# Altium project EP4_ECD_Electrica_Power_System.PrjPcb
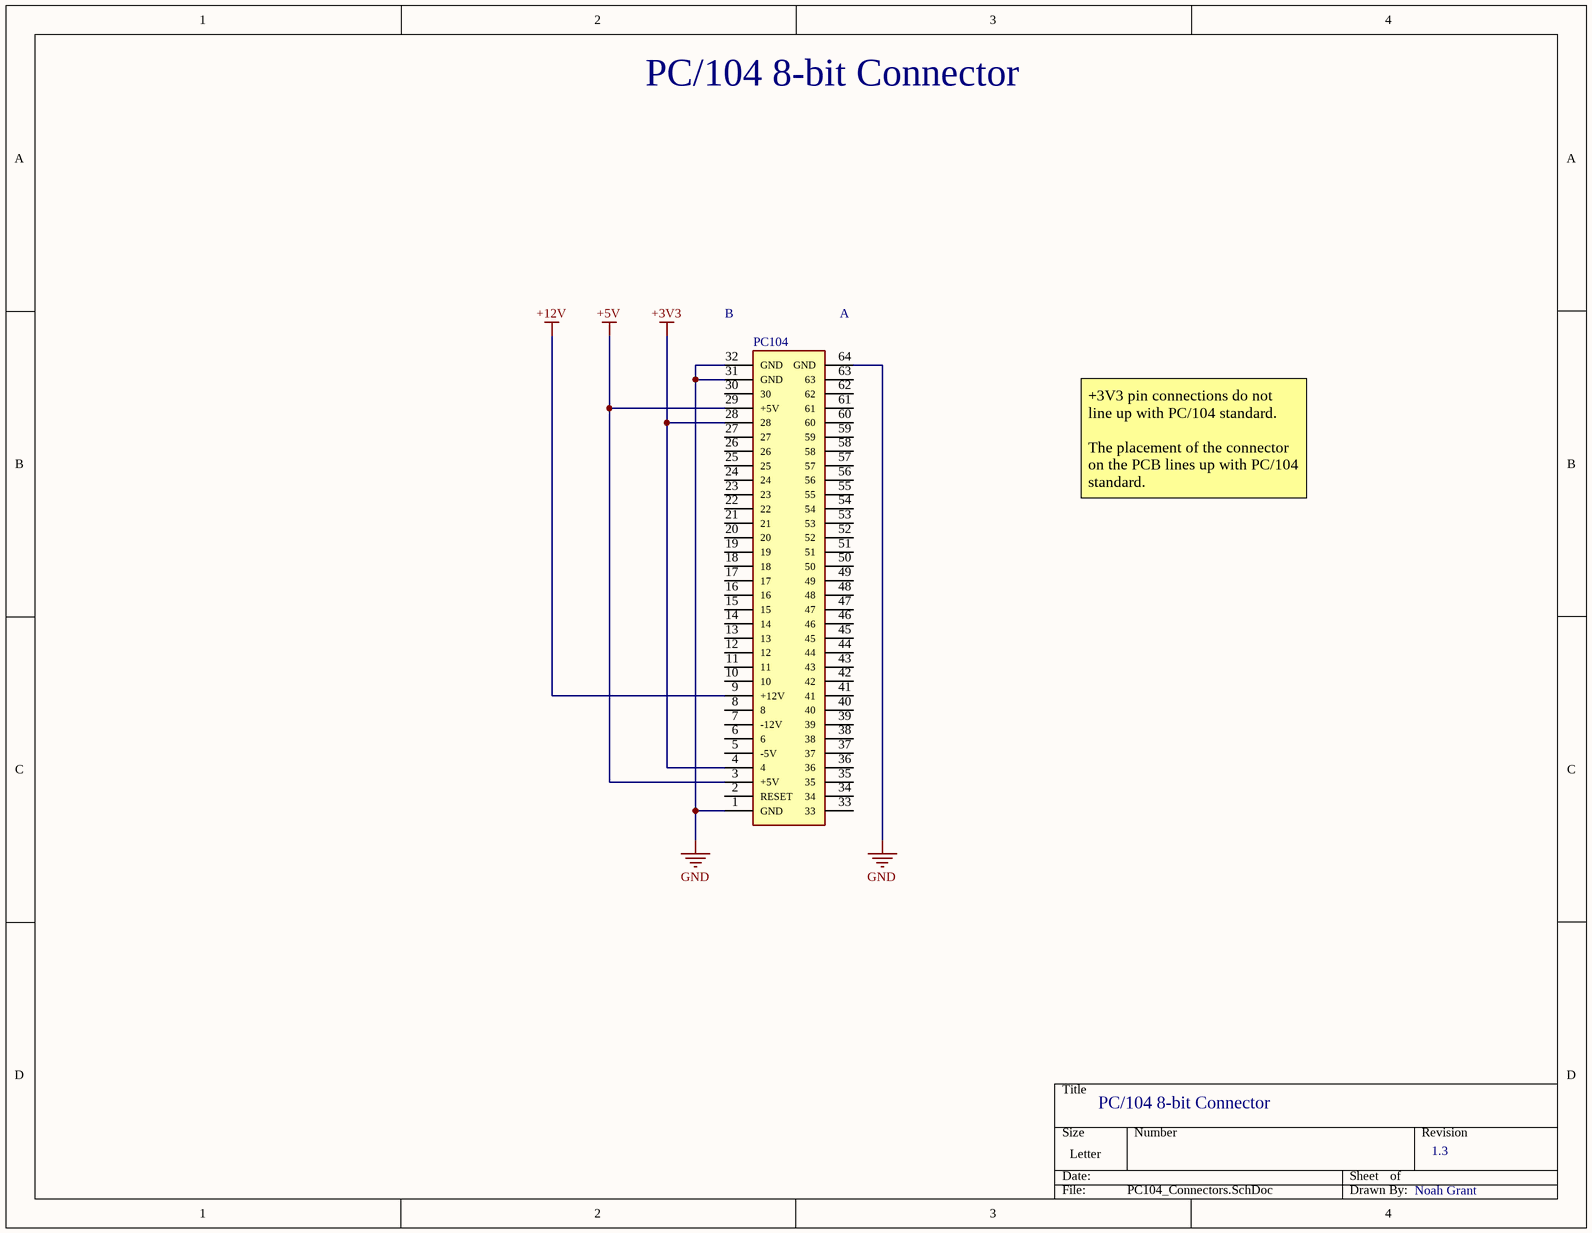
[diagram p0: PC104_Connectors.SchDoc]
3 sheets, 41 parts. Net scope: global (net labels, ports and power ports of the same name join across sheets).
Board file: PWR.PcbDoc
Sheets:
  PC104_Connectors.SchDoc
  Power.SchDoc
  R-Pi3.SchDoc

## Sheet PC104_Connectors.SchDoc
size Letter; SheetNumber: 1; SheetTotal: 2

### Parts
PC104  10153302-32111LF  [RHDR64W74P254_2X32_8238X499X1115P]  (value not drawn)

### Nets
+3V3: PC104.4 PC104.28
+5V: PC104.3(+5V) PC104.29(+5V)
+12V: PC104.9(+12V)
GND: PC104.1(GND) PC104.31(GND) PC104.32(GND) PC104.64(GND)

Not connected (* = marked no-connect by the designer): PC104 2(RESET) 5(-5V) 6 7(-12V) 8 10 11 12 13 14 15 16 17 18 19 20 21 22 23 24 25 26 27 30 33 34 35 36 37 38 39 40 41 42 43 44 45 46 47 48 49 50 51 52 53 54 55 56 57 58 59 60 61 62 63

### Notes on the sheet
- PC/104 8-bit Connector
- (near PC104) B
- (near PC104) A
- +3V3 pin connections do not line up with PC/104 standard.
  The placement of the connector on the PCB lines up with PC/104 standard.
- 1.3
- Noah Grant

### Library data of the parts
PC104 = 10153302-32111LF: Connector; Manufacturer_Name: Amphenol Communication Solutions; Datasheet Link: https://cdn.amphenol-cs.com/media/wysiwyg/files/drawing/10153302.pdf; Height: 11.15mm; Manufacturer_Part_Number: 10153302-32111LF

## Sheet Power.SchDoc: ECD PWR Board
size Letter; Date: 2023-01-12; Author: Noah Grant; CompanyName: ESE W23; DrawnBy: Noah Grant; Organization: Conestoga College; SheetNumber: 2; SheetTotal: 3
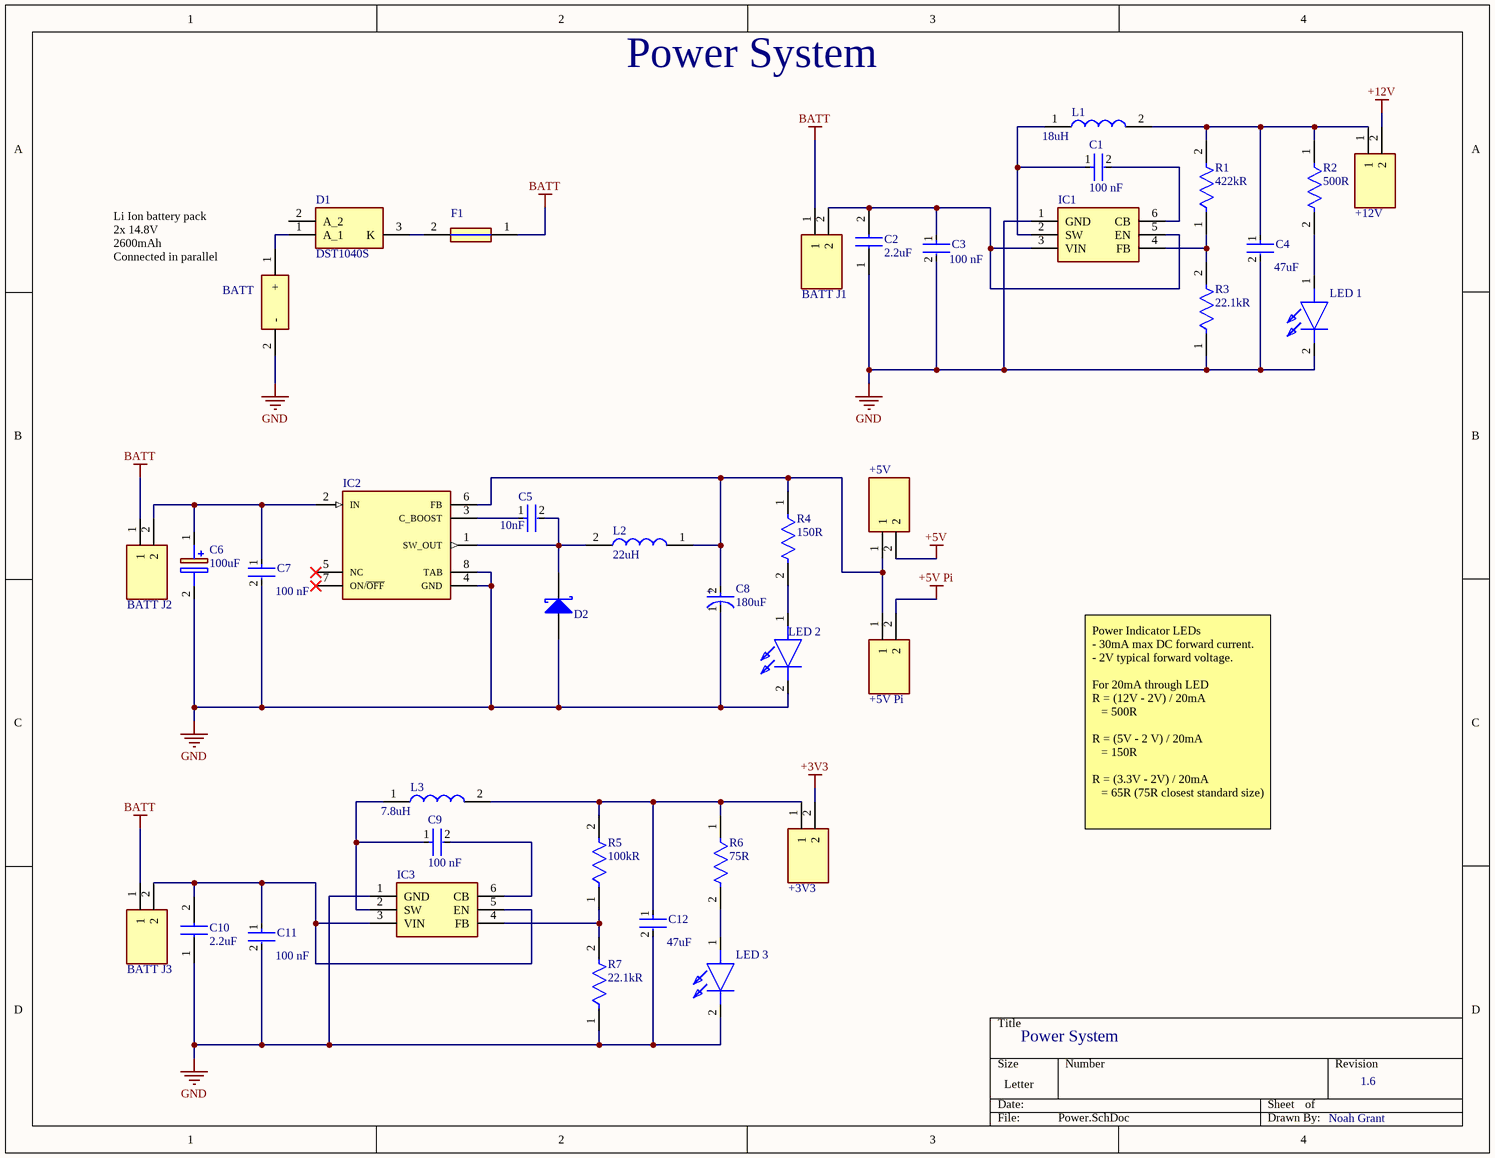
[diagram p1: Power.SchDoc]

### Parts
+3V3  0022284023  [HDRV2W87P0X254_1X2_508X249X863P]  (value not drawn)
+5V  0022284023  [HDRV2W87P0X254_1X2_508X249X863P]  (value not drawn)
+5V_Pi  0022284023  [HDRV2W87P0X254_1X2_508X249X863P]  (value not drawn)
+12V  0022284023  [HDRV2W87P0X254_1X2_508X249X863P]  (value not drawn)
BATT  1702473  [1702473]  (value not drawn)
BATT_J1  0022284023  [HDRV2W87P0X254_1X2_508X249X863P]  (value not drawn)
BATT_J2  0022284023  [HDRV2W87P0X254_1X2_508X249X863P]  (value not drawn)
BATT_J3  0022284023  [HDRV2W87P0X254_1X2_508X249X863P]  (value not drawn)
C1  Capacitance: 100 nF  [FP-CC0603-DA-MFG]  (hidden comment: CC0603KPX7R9BB104)
C2  Capacitance: 2.2uF  [CAPC3216X180N]  (hidden comment: GRM31CR61H225KA88L)
C3  Capacitance: 100 nF  [FP-CC0603-DA-MFG]  (hidden comment: CC0603KPX7R9BB104)
C4  Capacitance: 47uF  [FP-GRM32E-0_3-0_2-IPC_C]  (hidden comment: GRM32ER61C476KE15L)
C5  Capacitance: 10nF  [FP-CGA4J-IPC_B]  (hidden comment: CGA4C2C0G1H103J060AA)
C6  Capacitance: 100uF  [CAPAE1030X1050N]  (hidden comment: 50PFV100M10X10.5)
C7  Capacitance: 100 nF  [FP-CC0603-DA-MFG]  (hidden comment: CC0603KPX7R9BB104)
C8  Capacitance: 180uF  [FP-OS-CON-SMT-C6-MFG]  (hidden comment: 16SVPF180M)
C9  Capacitance: 100 nF  [FP-CC0603-DA-MFG]  (hidden comment: CC0603KPX7R9BB104)
C10  Capacitance: 2.2uF  [CAPC3216X180N]  (hidden comment: GRM31CR61H225KA88L)
C11  Capacitance: 100 nF  [FP-CC0603-DA-MFG]  (hidden comment: CC0603KPX7R9BB104)
C12  Capacitance: 47uF  [FP-GRM32E-0_3-0_2-IPC_C]  (hidden comment: GRM32ER61C476KE15L)
D1  DST1040S  [DST1040SA]
D2  B560C-13-F  [DIOD-B5X0C-2_M]  (value not drawn)
F1  TR2_6125FF5-R  [FUSC8640X287N]  (value not drawn)
IC1  LMR51420XDDCR  [SOT95P280X110-6N]  (value not drawn)
IC2  LM2677SX-5.0/NOPB  [TO127P1435X464-8N]  (value not drawn)
IC3  LMR51420XDDCR  [SOT95P280X110-6N]  (value not drawn)
L1  Inductance: 18uH  [SRR1210]  (hidden comment: SRR1210-180M)
L2  Inductance: 22uH  [INDPM132125X500N]  (hidden comment: MPX1D1250L220)
L3  Inductance: 7.8uH  [WE-HCI_103023]  (hidden comment: 744325780)
LED_1  APL3015EC-F01  [APL3015ECF01]  (value not drawn)
LED_2  APL3015EC-F01  [APL3015ECF01]  (value not drawn)
LED_3  APL3015EC-F01  [APL3015ECF01]  (value not drawn)
R1  Resistance: 422kR  [FP-ERA6A-IPC_A]  (hidden comment: ERA-6AEB4223V)
R2  500R  [FP-TFCR0603-IPC_A]
R3  Resistance: 22.1kR  [FP-RNCP0805-IPC_C]  (hidden comment: RNCP0805FTD22K1)
R4  150R  [FP-MCT0603-IPC_C]
R5  Resistance: 100kR  [FP-RC0603-0_55-MFG]  (hidden comment: RC0603FR-07100KL)
R6  75R  [FP-RT0603-MFG]
R7  Resistance: 22.1kR  [FP-RNCP0805-IPC_C]  (hidden comment: RNCP0805FTD22K1)

### Nets
+3V3: +3V3.2
+5V: +5V.2
+5V Pi: +5V_Pi.2
+12V: +12V.2
BATT: BATT_J1.1 BATT_J2.1 BATT_J3.1 F1.1
GND: BATT.2(-) C2.1 C3.2 C4.2 C6.2(-) C7.2 C8.1(C) C10.1 C11.2 C12.2 D2.2(A) IC1.1(GND) IC2.4(GND) IC2.8(TAB) IC3.1(GND) LED_1.2(K) LED_2.2(K) LED_3.2(K) R3.1 R7.1
Net+3V3_1: +3V3.1 C12.1 L3.2 R5.2 R6.1
Net+5V_1: +5V.1 +5V_Pi.1 C8.2(A) IC2.6(FB) L2.1 R4.1
Net+12V_1: +12V.1 C4.1 L1.2 R1.2 R2.1
NetBATT_1: BATT.1(+) D1.1(A_1)
NetBATT_J1_2: BATT_J1.2 C2.2 C3.1 IC1.3(VIN) IC1.5(EN)
NetBATT_J2_2: BATT_J2.2 C6.1(+) C7.1 IC2.2(IN)
NetBATT_J3_2: BATT_J3.2 C10.2 C11.1 IC3.3(VIN) IC3.5(EN)
NetC1_1: C1.1 IC1.2(SW) L1.1
NetC1_2: C1.2 IC1.6(CB)
NetC5_1: C5.1 IC2.3(C_BOOST)
NetC5_2: C5.2 D2.1(K) IC2.1(SW_OUT) L2.2
NetC9_1: C9.1 IC3.2(SW) L3.1
NetC9_2: C9.2 IC3.6(CB)
NetD1_3: D1.3(K) F1.2
NetIC1_4: IC1.4(FB) R1.1 R3.2
NetIC3_4: IC3.4(FB) R5.1 R7.2
NetLED_1_1: LED_1.1(A) R2.2
NetLED_2_1: LED_2.1(A) R4.2
NetLED_3_1: LED_3.1(A) R6.2

Not connected (* = marked no-connect by the designer): D1 2(A_2); IC2 5(NC)* 7(ON/~{OFF})*

### Notes on the sheet
- Power System
- (near BATT) Li Ion battery pack
  2x 14.8V
  2600mAh
  Connected in parallel
- Power Indicator LEDs
  - 30mA max DC forward current.
  - 2V typical forward voltage.
  For 20mA through LED
  R = (12V - 2V) / 20mA
  = 500R
  R = (5V - 2 V) / 20mA
  = 150R
  R = (3.3V - 2V) / 20mA
  = 65R (75R closest standard size)
- 1.6
- Noah Grant
- (in symbol CMP-05428-001090-1) +

### Library data of the parts
+3V3 +5V +5V_Pi +12V BATT_J1-BATT_J3 = 0022284023: Connector; Manufacturer_Name: Molex; Datasheet Link: https://www.molex.com/pdm_docs/sd/022284023_sd.pdf; Height: 8.63mm; Manufacturer_Part_Number: 0022284023; Mouser Part Number: N/A; Mouser Price/Stock: https://www.mouser.co.uk/ProductDetail/Molex/0022284023?qs=PBcRNPEHKsr%2FPE%2F%252B8ije0g%3D%3D; Arrow Part Number: 0022284023; Arrow Price/Stock: https://www.arrow.com/en/products/0022284023/molex
BATT = 1702473: Connector; Manufacturer_Name: Phoenix Contact; Datasheet Link: http://www.phoenixcontact.com/de/produkte/1702473/pdf; Height: 5.22mm; Manufacturer_Part_Number: 1702473; Mouser Part Number: 651-1702473; Mouser Price/Stock: https://www.mouser.co.uk/ProductDetail/Phoenix-Contact/1702473?qs=i0qWf6NAoDu6Kp2LncOlag%3D%3D; Arrow Part Number: 1702473; Arrow Price/Stock: https://www.arrow.com/en/products/1702473/phoenix-contact?region=nac
C1 C3 C7 C9 C11 = CMP-03422-000468-1: CAP CER 0.1UF 50V X7R 0603; Manufacturer: YAGEO; Temperature Coefficient: 15%; Material: Ceramic; Value: 100 nF; Tolerance: 0.1; Device Class L1: Passive Components; Temperature Range High: +125°C; ComponentLink2Description: Datasheet; Temperature Characteristic: X7R; Octopart: https://octopart.com/cc0603kpx7r9bb104-yageo-12885113; Height: 0.9mm; Mouser Description: Multilayer Ceramic Capacitors MLCC - SMD/SMT 100nF 50V X7R 10%; Device Class L3: Ceramic Capacitors; Voltage Rating: 50 V; Device Class L2: Capacitors; ComponentLink2URL: http://www.yageo.com/documents/recent/UPY-GPHC_X7R_6.3V-to-50V_18.pdf; Package: CC0603-DA; Manufacturer Part Number: CC0603KPX7R9BB104; Automotive: No; Voltage: 50 V; RoHS: TRUE; Lead Free: Yes; Digikey Description: CAP CER 0.1UF 50V X7R 0603; Footprint Url: http://www.yageo.com/exep/pages/download/literatures/UPY-C_GEN_24.pdf; Temperature Range Low: -55°C; Temperature: -55°C to +125°C; Category: Cap
C2 C10 = GRM31CR61H225KA88L: Capacitor; Manufacturer_Name: Murata Electronics; Datasheet Link: https://datasheet.datasheetarchive.com/originals/distributors/Datasheets_SAMA/ec4f1577dddcc7a13ddad897a28002d3.pdf; Height: 1.8mm; Manufacturer_Part_Number: GRM31CR61H225KA88L; Mouser Part Number: 81-GRM31CR61H225KA8L; Mouser Price/Stock: https://www.mouser.co.uk/ProductDetail/Murata-Electronics/GRM31CR61H225KA88L?qs=PNuoBeNXpiW6XsFe%2FHBnHw%3D%3D
C4 C12 = CMP-2000-06362-2: CAP CER 47UF 16V X5R 1210; Tolerance: 10%; Material: Ceramic; Case Code (Metric): 3225; RoHS Compliant: Yes; Min Operating Temperature: -55°C; Radiation Hardening: No; Voltage: 16V; Package Quantity: 1; Case Code (Imperial): 1210; REACH SVHC: No SVHC; Voltage Rating (DC): 16V; Dielectric: X5R; Case/Package: 1210; Length: 3.2mm; Voltage Rating: 16V; Packaging: Cut Tape; Width: 0.098inch; Number of Pins: 2; Lead Free: Lead Free; Height: 2.5mm; Mount: Surface Mount; Termination: SMD/SMT; Max Operating Temperature: 85°C; Thickness: 0.106inch; Depth: 2.5mm
C5 = CMP-08246-000595-1: Cap Ceramic 10nF 50V C0G 5% Pad SMD 0805 +125°C Automotive T/R; Max Operating Temperature: 125°C; Voltage Rating (DC): 50V; Packaging: Tape and Reel; Composition: Ceramic; Case/Package: 0805; REACH SVHC: No SVHC; Dielectric: C0G; Depth: 1.25mm; Min Operating Temperature: -55°C; Termination: SMD/SMT; Length: 2mm; Case Code (Metric): 2012; Thickness: 0.028inch; Ratings: AEC-Q200; Package Quantity: 1; Case Code (Imperial): 0805; Tolerance: 5%; Voltage Rating: 50V; Radiation Hardening: No; Lead Free: Lead Free; Height: 0.6mm; Mount: Surface Mount; Weight: 0.000194oz; Width: 0.049inch
C6 = 50PFV100M10X10.5: Capacitor Polarised; Manufacturer_Name: Rubycon; Datasheet Link: https://www.mouser.jp/datasheet/2/977/e_PFV-1600672.pdf; Height: 10.5mm; Manufacturer_Part_Number: 50PFV100M10X10.5; Mouser Part Number: 232-50PFV100M10X10.5; Mouser Price/Stock: https://www.mouser.co.uk/ProductDetail/Rubycon/50PFV100M10X10.5?qs=T3oQrply3y%252BvhjwV%252B%252Bv4tQ%3D%3D; Arrow Part Number: 50PFV100M10X10.5; Arrow Price/Stock: https://www.arrow.com/en/products/50pfv100m10x10.5/rubycon?region=nac
C8 = CMP-05428-001090-1: Conductive Polymer Aluminum Solid Capacitors (OS-CON) 180uF ±20% 16V; Polarity: Polar; Dissipation Factor: 12%; Ripple Current: 3.3A; ESR (Equivalent Series Resistance): 22mR; Leakage Current: 576uA; Life (Hours): 5000Hour; Min Operating Temperature: -55°C; REACH SVHC: No SVHC; Height: 5.9mm; Case/Package: Radial; Packaging: Tape and Reel; Termination: SMD/SMT; Max Operating Temperature: 105°C; Package Quantity: 1; RoHS Compliant: Yes; Number of Pins: 6; Tolerance: 20%; Lead Free: Lead Free; Mount: Surface Mount; Voltage Rating: 16V; Length: 5.9mm; Height - Seated (Max): 0.236inch; Voltage Rating (DC): 16V; Radiation Hardening: No; Voltage: 16V; Diameter: 6.3mm; Series: OS-CON™, SVPF; Ripple Current (AC): 3.3A; Construction: Cylindrical
D1 = DST1040S: Schottky Diode; Manufacturer_Name: LITTELFUSE; Datasheet Link: https://m.littelfuse.com/~/media/electronics/datasheets/power_semiconductors/littelfuse_power_semiconductor_schottky_diode_dst1040s_datasheet.pdf.pdf; Height: 1.25mm; Manufacturer_Part_Number: DST1040S; Mouser Part Number: 576-DST1040S; Mouser Price/Stock: https://www.mouser.co.uk/ProductDetail/Littelfuse/DST1040S?qs=%252BC9Bk%2FBEkFwEQIZlBedqnA%3D%3D; Arrow Part Number: DST1040S; Arrow Price/Stock: https://www.arrow.com/en/products/dst1040s/littelfuse
D2 = CMP-2000-05098-2: Schottky Barrier Rectifier, 5 A, 60 V, -55 to 125 degC, 2-Pin SMD, RoHS, Tape and Reel; Ir - Reverse Current: 500uA; Configuration: Single; Ifsm - Forward Surge Current: 100A; Vrrm - Repetitive Reverse Voltage: 60V; Brand: DiodesIncorporated; Vf - Forward Voltage: 0.7V; If - Forward Current: 5A; Unit Weight: 0.007408oz; Type: SchottkyBarrierRectifier; Package / Case: SMC; Manufacturer URL: http://www.diodes.com/; Datasheet URL: https://datasheet.ciiva.com/27052/1538961-27052355.pdf; Factory Pack Quantity: 3000; Height: 2.5mm; Width: 6.22mm; Product Category: SchottkyDiodes&Rectifiers; Minimum Operating Temperature: -55C; Manufacturer: DiodesIncorporated; Datasheet Version: Rev. 7-2, 06/2007; Product: SchottkyDiodes; Maximum Operating Temperature: +125C; Operating Temperature Range: -55Cto+125C; Technology: Si; Length: 7.11mm; RoHS: True; Packaging: Reel; Termination Style: SMD/SMT; Series: B560; Mounting Style: SMD/SMT
F1 = TR2_6125FF5-R: Fuse; Manufacturer_Name: Eaton; Manufacturer_Part_Number: TR2/6125FF5-R; Datasheet Link: https://ms.componentsearchengine.com/Datasheets/2/TR2_6125FF5-R.pdf; Height: 2.87mm
IC1 IC3 = LMR51420XDDCR: Integrated Circuit; Manufacturer_Name: Texas Instruments; Datasheet Link: https://www.ti.com/lit/ds/symlink/lmr51420.pdf?ts=1663231243064; Height: 1.1mm; Manufacturer_Part_Number: LMR51420XDDCR; Mouser Part Number: 595-LMR51420XDDCR; Mouser Price/Stock: https://www.mouser.co.uk/ProductDetail/Texas-Instruments/LMR51420XDDCR?qs=vvQtp7zwQdN6fBqQU4azxw%3D%3D
IC2 = LM2677S-ADJ_NOPB: Integrated Circuit; Manufacturer_Name: Texas Instruments; Manufacturer_Part_Number: LM2677S-ADJ/NOPB; Datasheet Link: http://www.ti.com/lit/ds/symlink/lm2677.pdf; Height: 4.64mm; Mouser Part Number: 926-LM2677S-ADJ/NOPB; Mouser Price/Stock: https://www.mouser.co.uk/ProductDetail/Texas-Instruments/LM2677S-ADJ-NOPB?qs=X1J7HmVL2ZFcqPykAfO2og%3D%3D; Arrow Part Number: LM2677S-ADJ/NOPB; Arrow Price/Stock: https://www.arrow.com/en/products/lm2677s-adjnopb/texas-instruments
L1 = SRR1210-180M: Inductor; Manufacturer_Name: Bourns; Datasheet Link: https://www.bourns.com/pdfs/SRR1210.pdf; Manufacturer_Part_Number: SRR1210-180M; Mouser Part Number: 652-SRR1210-180M; Mouser Price/Stock: https://www.mouser.co.uk/ProductDetail/Bourns/SRR1210-180M?qs=4vvWAaIu%2Fq5trcUyNP0dXQ%3D%3D; Arrow Part Number: SRR1210-180M; Arrow Price/Stock: https://www.arrow.com/en/products/srr1210-180m/bourns
L2 = MPX1D1250L220: Inductor; Manufacturer_Name: KEMET; Datasheet Link: https://content.kemet.com/datasheets/KEM_L9012_MPX.pdf; Height: 5mm; Manufacturer_Part_Number: MPX1D1250L220
L3 = 744325780: Inductor; Manufacturer_Name: Wurth Elektronik; Manufacturer_Part_Number: 744325780; Mouser Part Number: 710-744325780; Mouser Price/Stock: https://www.mouser.co.uk/ProductDetail/Wurth-Elektronik/744325780?qs=VxkwJfKV0FQ2%2FeCS8beGcw%3D%3D
LED_1-LED_3 = APL3015EC-F01: LED; Manufacturer_Name: Kingbright; Datasheet Link: https://componentsearchengine.com/Datasheets/1/APL3015EC-F01.pdf; Manufacturer_Part_Number: APL3015EC-F01; Mouser Part Number: 604-APL3015EC-F01; Mouser Price/Stock: https://www.mouser.co.uk/ProductDetail/Kingbright/APL3015EC-F01?qs=VdjlWU%2FzoOF91deOgS6C3g%3D%3D
R1 = CMP-2001-00824-3: RES 422K OHM 0.1% 1/8W 0805; Max Power Dissipation: 125mW; Voltage Rating (DC): 100V; Temperature Coefficient: 25ppm/°C; Length: 2mm; Height: 0.5mm; Features: Automotive AEC-Q200; Contact Plating: Tin; Lead Free: Lead Free; Series: ERA-6A; Case/Package: 0805; Depth: 1.25mm; Technology: METAL FILM; Termination: Solder; Tolerance: 0.1%; Packaging: Tape and Reel; Package Quantity: 5000; Military Standard: Not; Case Code (Imperial): 0805; Mount: Surface Mount; Voltage Rating: 100V; Number of Terminations: 2; Reach SVHC Compliant: Yes; Resistance Tolerance: 0.1%; Max Operating Temperature: 155°C; Resistor Type: Thin Film; Number of Pins: 2; Construction: Rectangular; Case Code (Metric): 2012; Ratings: AEC-Q200; Min Operating Temperature: -55°C; Width: 1.25mm; Radiation Hardening: No; Power Rating: 125mW
R2 = CMP-250906-063952-1: RES Thin Film,  500Ω, 0.1%, 0.1W, 25ppm/°C, 0603; RoHS Compliant: Yes
R3 R7 = CMP-26527-000518-1: 22.1kΩ ±1% 0.25W 0805 High Power Anti-Sulfur Thin Film Chip Resistor; Max Power Dissipation: 250mW; Temperature Coefficient: 100ppm/°C; Case Code (Imperial): 0805; Number of Terminations: 2; Width: 0.049inch; Features: Moisture Resistant; Case Code (Metric): 2012; Packaging: Tape and Reel; Mount: Surface Mount; Resistor Type: Thin Film; Case/Package: 0805; Max Operating Temperature: 155°C; Min Operating Temperature: -55°C; Series: RNCP; RoHS Compliant: Yes; Length: 0.079inch; Tolerance: 1%; Height: 0.024inch
R4 = CMP-02407-011712-1: RES SMD 150 OHM 1% 1/8W 0603; Power Rating: 125mW; Tolerance: 0.5%; Voltage Rating: 75V; Max Power Dissipation: 150mW; Temperature Coefficient: 25ppm/°C; Resistance: 150R; Packaging: Tape and Reel; Termination: SMD/SMT; Construction: Rectangular; Max Operating Temperature: 175°C; Length: 0.061inch; Case/Package: 0603; Depth: 0.85mm; Military Standard: Not; Case Code (Metric): 1608; Package Quantity: 1; Width: 0.8mm; Features: Automotive AEC-Q200; Height: 0.022inch; REACH SVHC: No SVHC; Min Operating Temperature: -55°C; Resistor Type: Thin Film; RoHS Compliant: Yes; Resistance Tolerance: 0.5%; Series: MCT 0603 - Professional; Voltage Rating (DC): 75V; Number of Terminations: 2; Case Code (Imperial): 0603; Number of Pins: 2
R5 = CMP-2100-03662-2: RES SMD 100K OHM 1% 1/10W 0603; Voltage Rating (DC): 50V; Max Power Dissipation: 100mW; Temperature Coefficient: 100ppm/°C; Working Voltage: 75V; Length: 1.6mm; Lead Free: Lead Free; Number of Terminations: 2; Packaging: Tape and Reel; Voltage Rating: 50V; Termination: SMD/SMT; Width: 0.8mm; Resistor Type: Thick Film; Resistance Tolerance: 1%; Features: Moisture Resistant; Height: 0.45mm; Construction: Rectangular; Case/Package: 0603; Military Standard: Not; Case Code (Imperial): 0603; Series: RC; Technology: THICK FILM; Depth: 0.8mm; RoHS Compliant: Yes; REACH SVHC: No SVHC; Min Operating Temperature: -55°C; Case Code (Metric): 1608; Max Operating Temperature: 155°C; Power Rating: 100mW; Number of Pins: 2; Tolerance: 1%
R6 = CMP-2000-04797-2: RES SMD 75 OHM 1% 1/10W 0603; Manufacturer: Yageo; Manufacturer Part Number: RT0603FRE0775RL; Resistance: 75Ω; Voltage Rating: 75V; Tolerance: 0.01; Value: 75Ω; Power Rating: 0.1W; Temperature Coefficient: 50 ppm/°C; Ipc Land Pattern Name: RESC16080X45; Height: 0.55mm; Lead Free: Yes; Mouser Description: Res Thin Film 0603 75 Ohm 1% 1/10W ±50ppm/°C Molded SMD SMD Paper T/R; Device Class L2: Resistors; Device Class L1: Passive Components; Series: RT; Composition: Thin Film; Automotive: No; Footprint Url: http://www.yageo.com/exep/pages/download/literatures/PYu-R_Mount_10.pdf; Temperature: -55°C to +155°C; Temperature Range High: +155°C; Temperature Range Low: -55°C; ComponentLink2URL: http://www.yageo.com/documents/recent/PYu-RT_1-to-0.01_RoHS_L_9.pdf; Device Class L3: Chip SMD Resistors; Octopart: https://octopart.com/rt0603fre0775rl-yageo-1163751; ComponentLink2Description: Datasheet; RoHS: TRUE; Digikey Description: RES SMD 75 OHM 1% 1/10W 0603; Category: Res; Package: RT0603

## Sheet R-Pi3.SchDoc
size A4; SheetNumber: 3; SheetTotal: 3
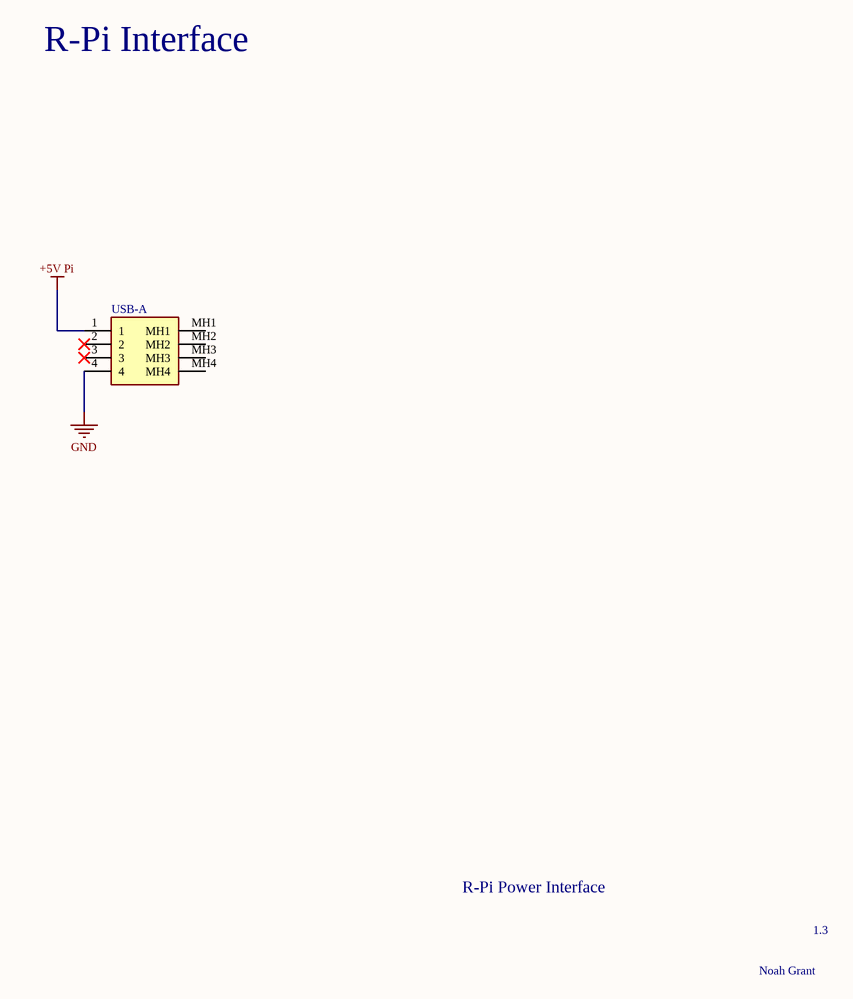
[diagram p2: R-Pi3.SchDoc]

### Parts
USB-A  73725-11A0RLF  [7372511A0RLF]  (value not drawn)

### Nets
+5V Pi: USB-A.1
GND: USB-A.4

Not connected (* = marked no-connect by the designer): USB-A 2* 3* MH1 MH2 MH3 MH4

### Notes on the sheet
- R-Pi Interface
- R-Pi Power Interface
- 1.3
- Noah Grant

### Library data of the parts
USB-A = 73725-11A0RLF: Connector; Manufacturer_Name: Amphenol Communication Solutions; Datasheet Link: https://cdn.amphenol-cs.com/media/wysiwyg/files/drawing/73725.pdf; Height: 15.83mm; Manufacturer_Part_Number: 73725-11A0RLF; Arrow Part Number: 73725-11A0RLF; Arrow Price/Stock: https://www.arrow.com/en/products/73725-11a0rlf/amphenol-fci?region=europe

## Nets that join several sheets
+3V3: PC104_Connectors (PC104.4 PC104.28), Power (+3V3.2)
+5V: PC104_Connectors (PC104.3 PC104.29), Power (+5V.2)
+5V Pi: Power (+5V_Pi.2), R-Pi3 (USB-A.1)
+12V: PC104_Connectors (PC104.9), Power (+12V.2)
GND: PC104_Connectors (PC104.1 PC104.31 PC104.32 PC104.64), Power (20 pins), R-Pi3 (USB-A.4)